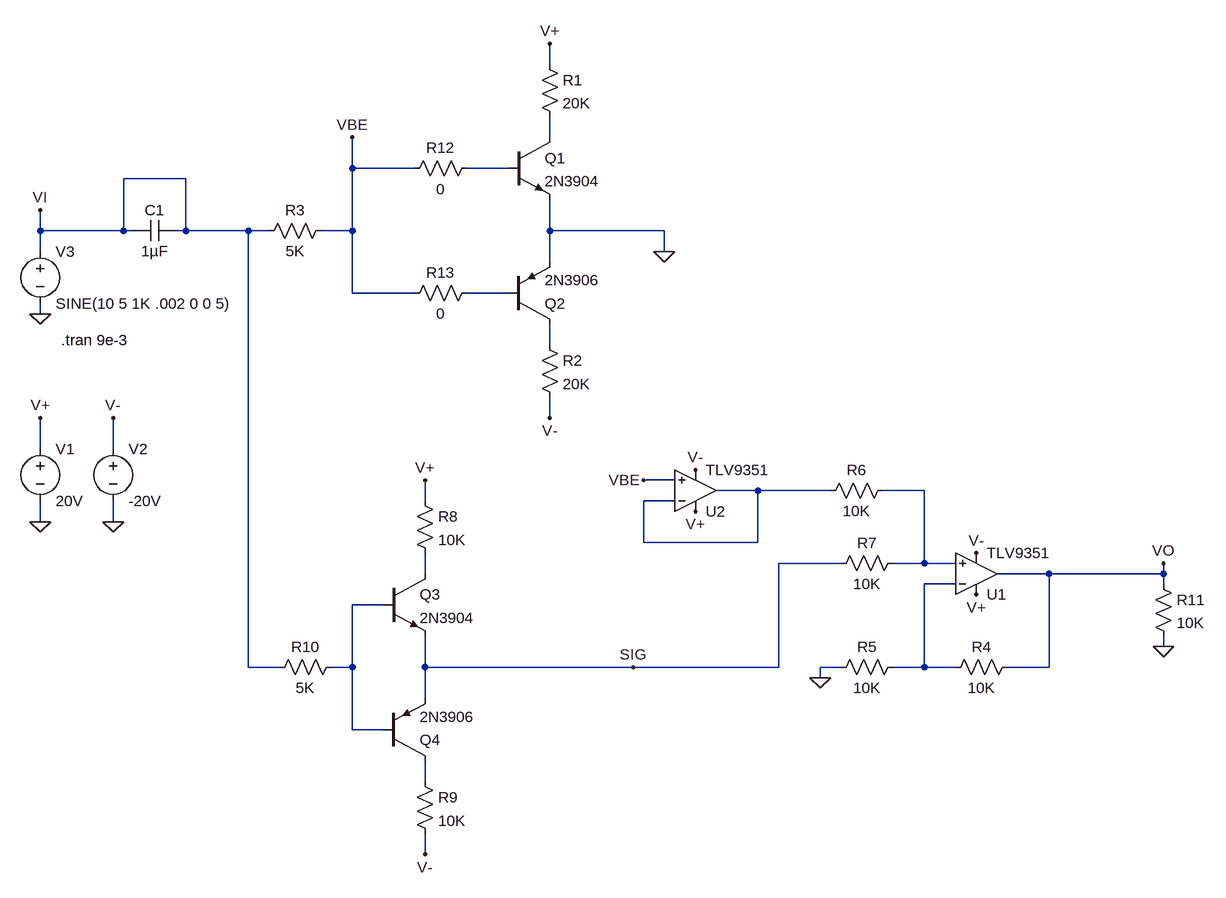
[diagram p0: schematic Add_Back_In_Vbe_Offset.asc]
Add_Back_In_Vbe_Offset.asc, the LTspice schematic file:
Version 4
SHEET 1 1476 1272
WIRE 464 -16 464 -48
WIRE 464 96 464 64
WIRE 160 144 160 96
WIRE 256 144 160 144
WIRE 400 144 336 144
WIRE -96 160 -192 160
WIRE -320 240 -320 208
WIRE -192 240 -192 160
WIRE -192 240 -320 240
WIRE -176 240 -192 240
WIRE -96 240 -96 160
WIRE -96 240 -112 240
WIRE 0 240 -96 240
WIRE 32 240 0 240
WIRE 160 240 160 144
WIRE 160 240 112 240
WIRE 464 240 464 192
WIRE 640 240 464 240
WIRE -320 272 -320 240
WIRE 640 272 640 240
WIRE 464 288 464 240
WIRE 160 336 160 240
WIRE 256 336 160 336
WIRE 400 336 336 336
WIRE -320 368 -320 352
WIRE 464 416 464 384
WIRE 464 528 464 496
WIRE -320 576 -320 528
WIRE -208 576 -208 528
WIRE 656 624 608 624
WIRE 784 640 720 640
WIRE 896 640 784 640
WIRE 1040 640 976 640
WIRE 272 656 272 624
WIRE 656 656 608 656
WIRE -320 688 -320 656
WIRE -208 688 -208 656
WIRE 608 720 608 656
WIRE 784 720 784 640
WIRE 784 720 608 720
WIRE 912 752 816 752
WIRE 1040 752 1040 640
WIRE 1040 752 992 752
WIRE 1088 752 1040 752
WIRE 272 768 272 736
WIRE 1232 768 1152 768
WIRE 1408 768 1408 752
WIRE 1408 768 1232 768
WIRE 1088 784 1040 784
WIRE 1408 784 1408 768
WIRE 208 816 160 816
WIRE 1408 880 1408 864
WIRE 0 912 0 240
WIRE 48 912 0 912
WIRE 160 912 160 816
WIRE 160 912 128 912
WIRE 272 912 272 864
WIRE 592 912 272 912
WIRE 816 912 816 752
WIRE 816 912 592 912
WIRE 912 912 880 912
WIRE 1040 912 1040 784
WIRE 1040 912 992 912
WIRE 1088 912 1040 912
WIRE 1232 912 1232 768
WIRE 1232 912 1168 912
WIRE 880 928 880 912
WIRE 272 960 272 912
WIRE 160 1008 160 912
WIRE 208 1008 160 1008
WIRE 272 1088 272 1056
WIRE 272 1200 272 1168
FLAG -320 368 0
FLAG -320 688 0
FLAG -208 688 0
FLAG 640 272 0
FLAG -320 528 V+
FLAG 464 -48 V+
FLAG -208 528 V-
FLAG 464 528 V-
FLAG 1120 800 V+
FLAG 1120 736 V-
FLAG 688 672 V+
FLAG 688 608 V-
FLAG 272 624 V+
FLAG 272 1200 V-
FLAG 880 928 0
FLAG 160 96 VBE
FLAG 608 624 VBE
FLAG 1408 880 0
FLAG 1408 752 VO
FLAG -320 208 VI
FLAG 592 912 SIG
SYMBOL npn 400 96 R0
SYMATTR InstName Q1
SYMATTR Value 2N3904
SYMBOL pnp 400 384 M180
SYMATTR InstName Q2
SYMATTR Value 2N3906
SYMBOL res 448 -32 R0
SYMATTR InstName R1
SYMATTR Value 20K
SYMBOL res 448 400 R0
SYMATTR InstName R2
SYMATTR Value 20K
SYMBOL res 128 224 R90
WINDOW 0 0 56 VBottom 2
WINDOW 3 32 56 VTop 2
SYMATTR InstName R3
SYMATTR Value 5K
SYMBOL voltage -320 560 R0
WINDOW 123 0 0 Left 0
WINDOW 39 0 0 Left 0
SYMATTR InstName V1
SYMATTR Value 20V
SYMBOL voltage -208 560 R0
WINDOW 123 0 0 Left 0
WINDOW 39 0 0 Left 0
SYMATTR InstName V2
SYMATTR Value -20V
SYMBOL voltage -320 256 R0
WINDOW 123 0 0 Left 0
WINDOW 39 0 0 Left 0
SYMATTR InstName V3
SYMATTR Value SINE(10 5 1K .002 0 0 5)
SYMBOL Hab_OpAmp\\TLV9351 1120 832 M180
SYMATTR InstName U1
SYMBOL res 1184 896 R90
WINDOW 0 0 56 VBottom 2
WINDOW 3 32 56 VTop 2
SYMATTR InstName R4
SYMATTR Value 10K
SYMBOL res 1008 896 R90
WINDOW 0 0 56 VBottom 2
WINDOW 3 32 56 VTop 2
SYMATTR InstName R5
SYMATTR Value 10K
SYMBOL res 992 624 R90
WINDOW 0 0 56 VBottom 2
WINDOW 3 32 56 VTop 2
SYMATTR InstName R6
SYMATTR Value 10K
SYMBOL res 1008 736 R90
WINDOW 0 0 56 VBottom 2
WINDOW 3 32 56 VTop 2
SYMATTR InstName R7
SYMATTR Value 10K
SYMBOL Hab_OpAmp\\TLV9351 688 704 M180
SYMATTR InstName U2
SYMBOL npn 208 768 R0
SYMATTR InstName Q3
SYMATTR Value 2N3904
SYMBOL pnp 208 1056 M180
SYMATTR InstName Q4
SYMATTR Value 2N3906
SYMBOL res 256 640 R0
SYMATTR InstName R8
SYMATTR Value 10K
SYMBOL res 256 1072 R0
SYMATTR InstName R9
SYMATTR Value 10K
SYMBOL res 144 896 R90
WINDOW 0 0 56 VBottom 2
WINDOW 3 32 56 VTop 2
SYMATTR InstName R10
SYMATTR Value 5K
SYMBOL res 1392 768 R0
SYMATTR InstName R11
SYMATTR Value 10K
SYMBOL cap -112 224 R90
WINDOW 0 0 32 VBottom 2
WINDOW 3 32 32 VTop 2
SYMATTR InstName C1
SYMATTR Value 1µF
SYMBOL res 352 128 R90
WINDOW 0 0 56 VBottom 2
WINDOW 3 32 56 VTop 2
SYMATTR InstName R12
SYMATTR Value 0
SYMBOL res 352 320 R90
WINDOW 0 0 56 VBottom 2
WINDOW 3 32 56 VTop 2
SYMATTR InstName R13
SYMATTR Value 0
TEXT -288 408 Left 2 !.tran 9e-3

The netlist it stands for:
* Add_Back_In_Vbe_Offset.asc
Q1 N001 N002 0 0 2N3904
Q2 N004 N003 0 0 2N3906
R1 V+ N001 20K
R2 N004 V- 20K
R3 VBE VI 5K
V1 V+ 0 20V
V2 V- 0 -20V
V3 VI 0 SINE(10 5 1K .002 0 0 5)
* U1: TLV9351 (symbol Hab_OpAmp\TLV9351 not available, pins judged from their places): In+=N006 In-=N008 V+=V+ V-=V- OUT=VO
R4 VO N008 10K
R5 N008 0 10K
R6 N006 N005 10K
R7 N006 SIG 10K
* U2: TLV9351 (symbol Hab_OpAmp\TLV9351 not available, pins judged from their places): In+=VBE In-=N005 V+=V+ V-=V- OUT=N005
Q3 N007 N009 SIG 0 2N3904
Q4 N010 N009 SIG 0 2N3906
R8 V+ N007 10K
R9 N010 V- 10K
R10 N009 VI 5K
R11 VO 0 10K
C1 VI VI 1µF
R12 N002 VBE 0
R13 N003 VBE 0
.model NPN NPN
.model PNP PNP
.lib standard.bjt
.tran 9e-3
.backanno
.end